# EAGLE design Blend_Control (EAGLE 6.3)
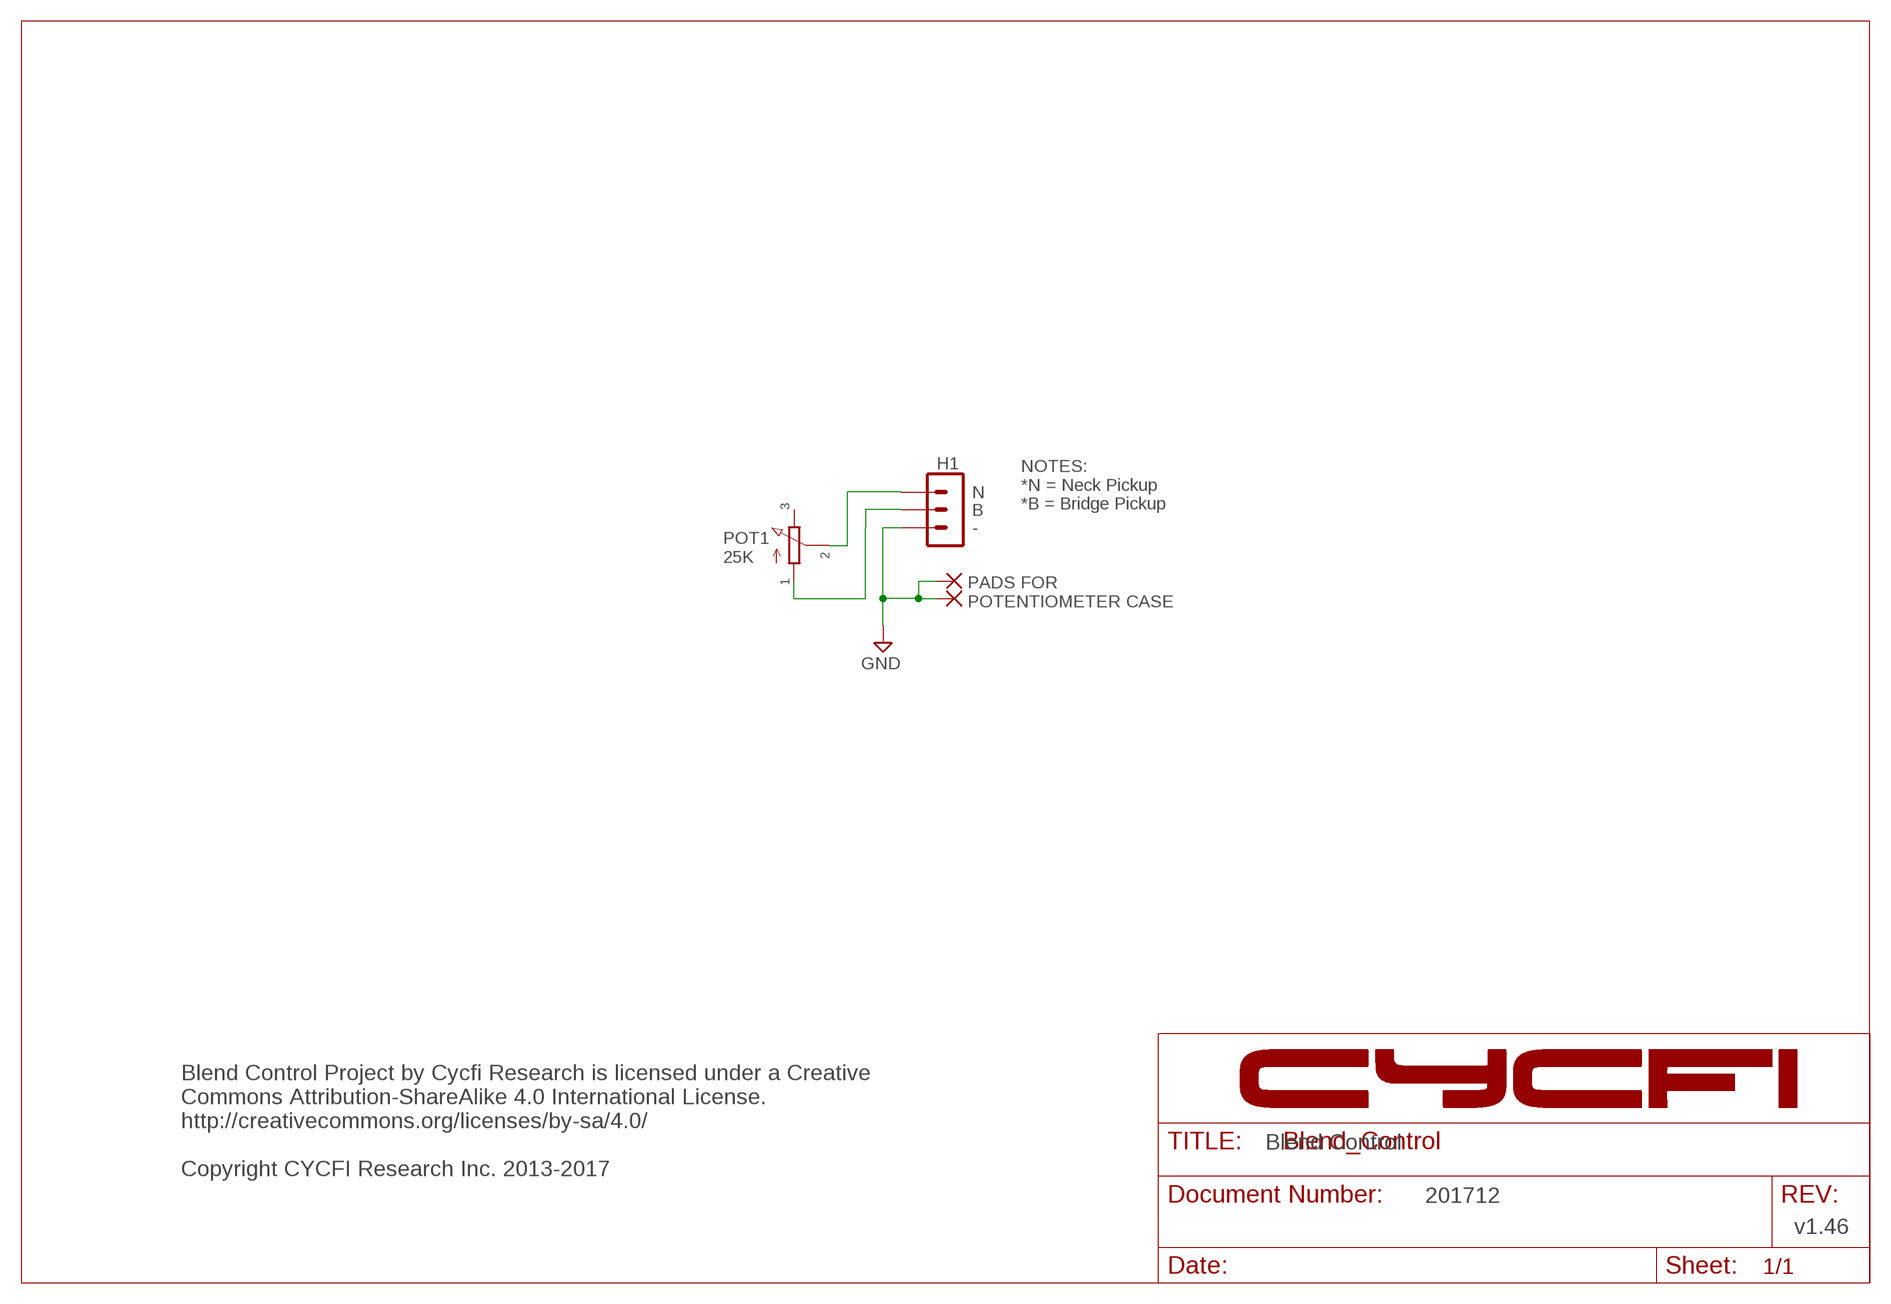
[diagram p0: schematic, sheet 1]

## Parts
GND3  SMD2  [SMD1,27-2,54]
GND4  SMD2  [SMD1,27-2,54]
H1  3PIN-SMD-2.54MM  [3P-SMD-2.54MM]
POT1  PDB181-GTR01  [PDB181]

## Nets
GND: GND3.1(P) GND4.1(P) H1.P$1
N$1: H1.P$3 POT1.P$2
N$3: H1.P$2 POT1.P$1
Unconnected: POT1.P$3

## Notes on the sheet
- N
- NOTES:
  *N = Neck Pickup
  *B = Bridge Pickup
- B
- -
- POT1
  25K
- PADS FOR 
  POTENTIOMETER CASE
- Blend Control
- Blend Control Project by Cycfi Research is licensed under a Creative 
  Commons Attribution-ShareAlike 4.0 International License. 
  http://creativecommons.org/licenses/by-sa/4.0/ 
  
  Copyright CYCFI Research Inc. 2013-2017
- 201712
- v1.46

## Library data of the parts
GND3 GND4 = wirepad:SMD2: SMD PAD
H1 = CYCFI_Con:3PIN-SMD-2.54MM
POT1 = CYCFI_Passive:PDB181-GTR01

## Board
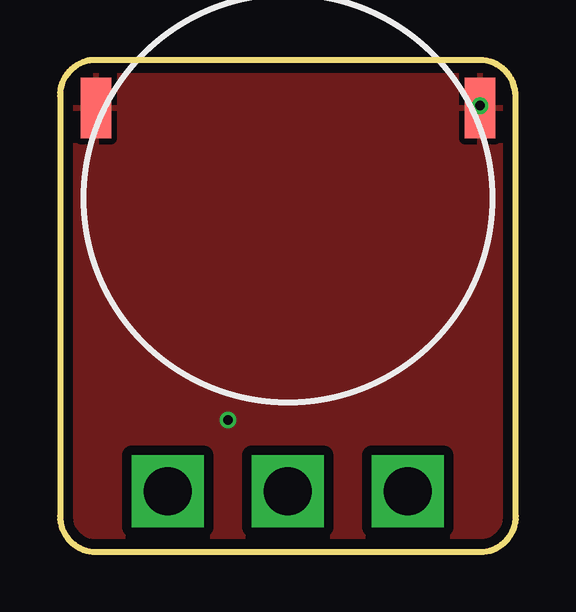
[diagram p1: board, top side]
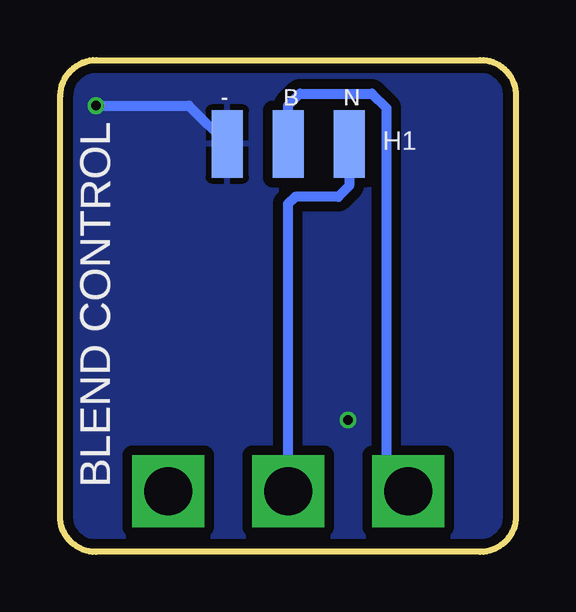
[diagram p2: board, bottom side, seen from below]

Size 19 x 20.5 mm. Coordinates in mm from the lower left corner, seen from the top.
Outline: 0,19 0,1.5 arc90 1.5,0 17.5,0 arc90 19,1.5 18.98,19 arc90 17.48,20.5 1.5,20.5 arc92 0,19
Copper layers (1*16): Top 0.035mm / dielectric 1.5mm / Bottom 0.035mm
Design rules "Fusion_eagle_rule_v1.1": minimum track width 6mil, minimum drill 12mil, track to track 6mil, track to pad 6mil, pad to pad 6mil, via to via 6mil, smd to smd 0mil, copper to edge 10mil, drill to drill 10mil, minimum pad ring 10mil, minimum via ring 6mil, stop-mask expansion 2mil, vias tented up to drill 100mil, thermal gap 10mil

### Footprints (pad centres in the part's own frame; a part is rotated, then mirrored left to right if it is on the bottom)
SMD1,27-2,54 = smd 1.27 x 2.54: 1 0,0
3P-SMD-2.54MM = smd 1.3 x 2.8: P$1 -2.54,0; P$2 0,0; P$3 2.54,0
PDB181 = drill 2 square: P$1 -5,0; P$2 0,0; P$3 5,0

### Placement (x,y rotation side)
GND3  1.5,18.5 0 top
GND4  17.5,18.5 0 top
H1  9.49,17 0 bottom
POT1  9.49,2.54 0 top

### Tracks (layer width: path | path; a pad name or v marks a point on that pad's centre or on a via)
GND  (via drill 0.4)
  Top 0.406: GND4.1 v17.5,18.6
  Bottom 0.406: v17.5,18.6 13.63,18.6 H1.P$1
  other vias: 7,5.5
  pour Top (isolate 0.406): 17.5,0 1.5,0 arc-90 0,1.5 0,19 arc-90 1.5,20.5 17.5,20.5 arc-90 19,19 19,1.5 arc-90
  pour Bottom (isolate 0.406): 17.5,0 1.5,0 arc-90 0,1.5 0,19 arc-90 1.5,20.5 17.5,20.5 arc-90 19,19 19,1.5 arc-90
N$1
  Bottom 0.406: H1.P$3 6.95,15.25 7.4,14.8 9.2,14.8 9.5,14.5 POT1.P$2
N$3
  Bottom 0.406: H1.P$2 9.49,18.61 9,19.1 6,19.1 5.4,18.5 5.4,3.45 POT1.P$1

### Text on the board
bNames: N | B | - | BLEND CONTROL
_bNames: N | B | - | H1 | BLEND CONTROL